# Altium schematic sheet Macropadmod.SchDoc
size A4
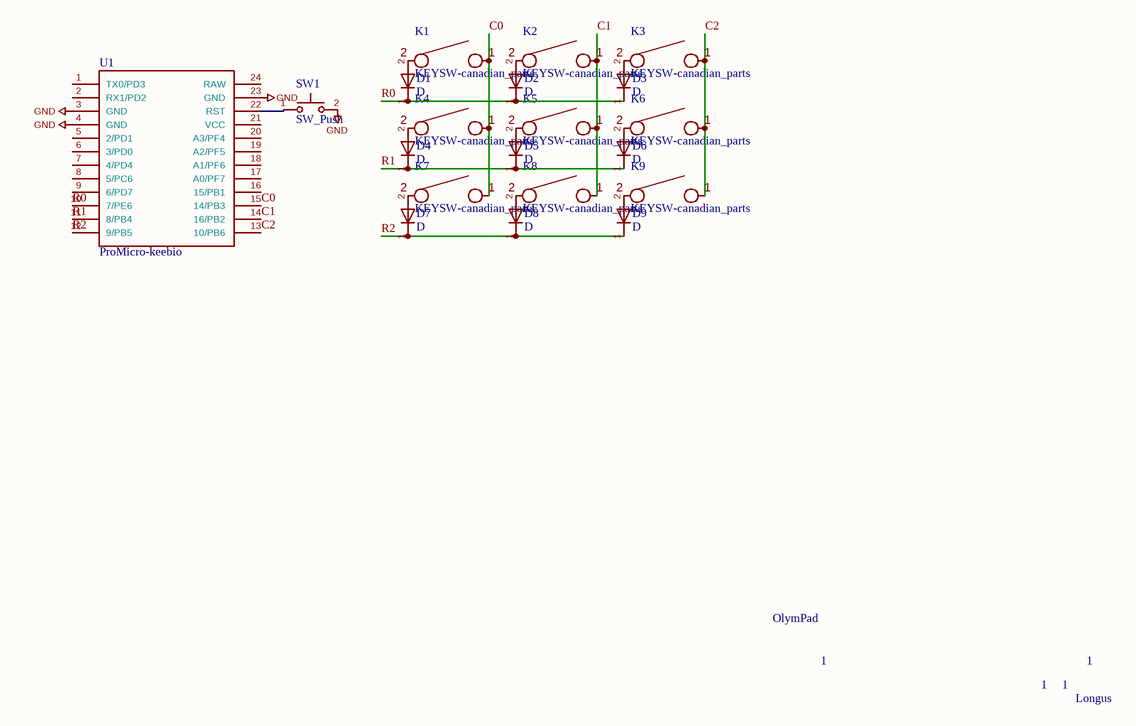
[diagram p0: Macropadmod.SchDoc]

## Parts
D1  D  [Diode]
D2  D  [Diode]
D3  D  [Diode]
D4  D  [Diode]
D5  D  [Diode]
D6  D  [Diode]
D7  D  [Diode]
D8  D  [Diode]
D9  D  [Diode]
K1  KEYSW-canadian_parts  [Socket]
K2  KEYSW-canadian_parts  [Socket]
K3  KEYSW-canadian_parts  [Socket]
K4  KEYSW-canadian_parts  [Socket]
K5  KEYSW-canadian_parts  [Socket]
K6  KEYSW-canadian_parts  [Socket]
K7  KEYSW-canadian_parts  [Socket]
K8  KEYSW-canadian_parts  [Socket]
K9  KEYSW-canadian_parts  [Socket]
SW1  SW_Push  [Reset]
U1  ProMicro-keebio  [Pro-Micro]

## Nets
GND: SW1.2 U1.3(GND) U1.4(GND) U1.23(GND)
C0: K1.1 K4.1 K7.1 U1.15(14/PB3)
C1: K2.1 K5.1 K8.1 U1.14(16/PB2)
C2: K3.1 K6.1 K9.1 U1.13(10/PB6)
R0: D1.1(K) D2.1(K) D3.1(K) U1.10(7/PE6)
R1: D4.1(K) D5.1(K) D6.1(K) U1.11(8/PB4)
R2: D7.1(K) D8.1(K) D9.1(K) U1.12(9/PB5)
NetD1_2: D1.2(A) K1.2
NetD2_2: D2.2(A) K2.2
NetD3_2: D3.2(A) K3.2
NetD4_2: D4.2(A) K4.2
NetD5_2: D5.2(A) K5.2
NetD6_2: D6.2(A) K6.2
NetD7_2: D7.2(A) K7.2
NetD8_2: D8.2(A) K8.2
NetD9_2: D9.2(A) K9.2
NetSW1_1: SW1.1 U1.22(RST)

Not connected (* = marked no-connect by the designer): U1 1(TX0/PD3) 2(RX1/PD2) 5(2/PD1) 6(3/PD0) 7(4/PD4) 8(5/PC6) 9(6/PD7) 16(15/PB1) 17(A0/PF7) 18(A1/PF6) 19(A2/PF5) 20(A3/PF4) 21(VCC) 24(RAW)

## Notes on the sheet
- OlymPad
- 1
- 1     1
- Longus